# Altium schematic sheet ADC-RDC-FPGA.SchDoc
size A3
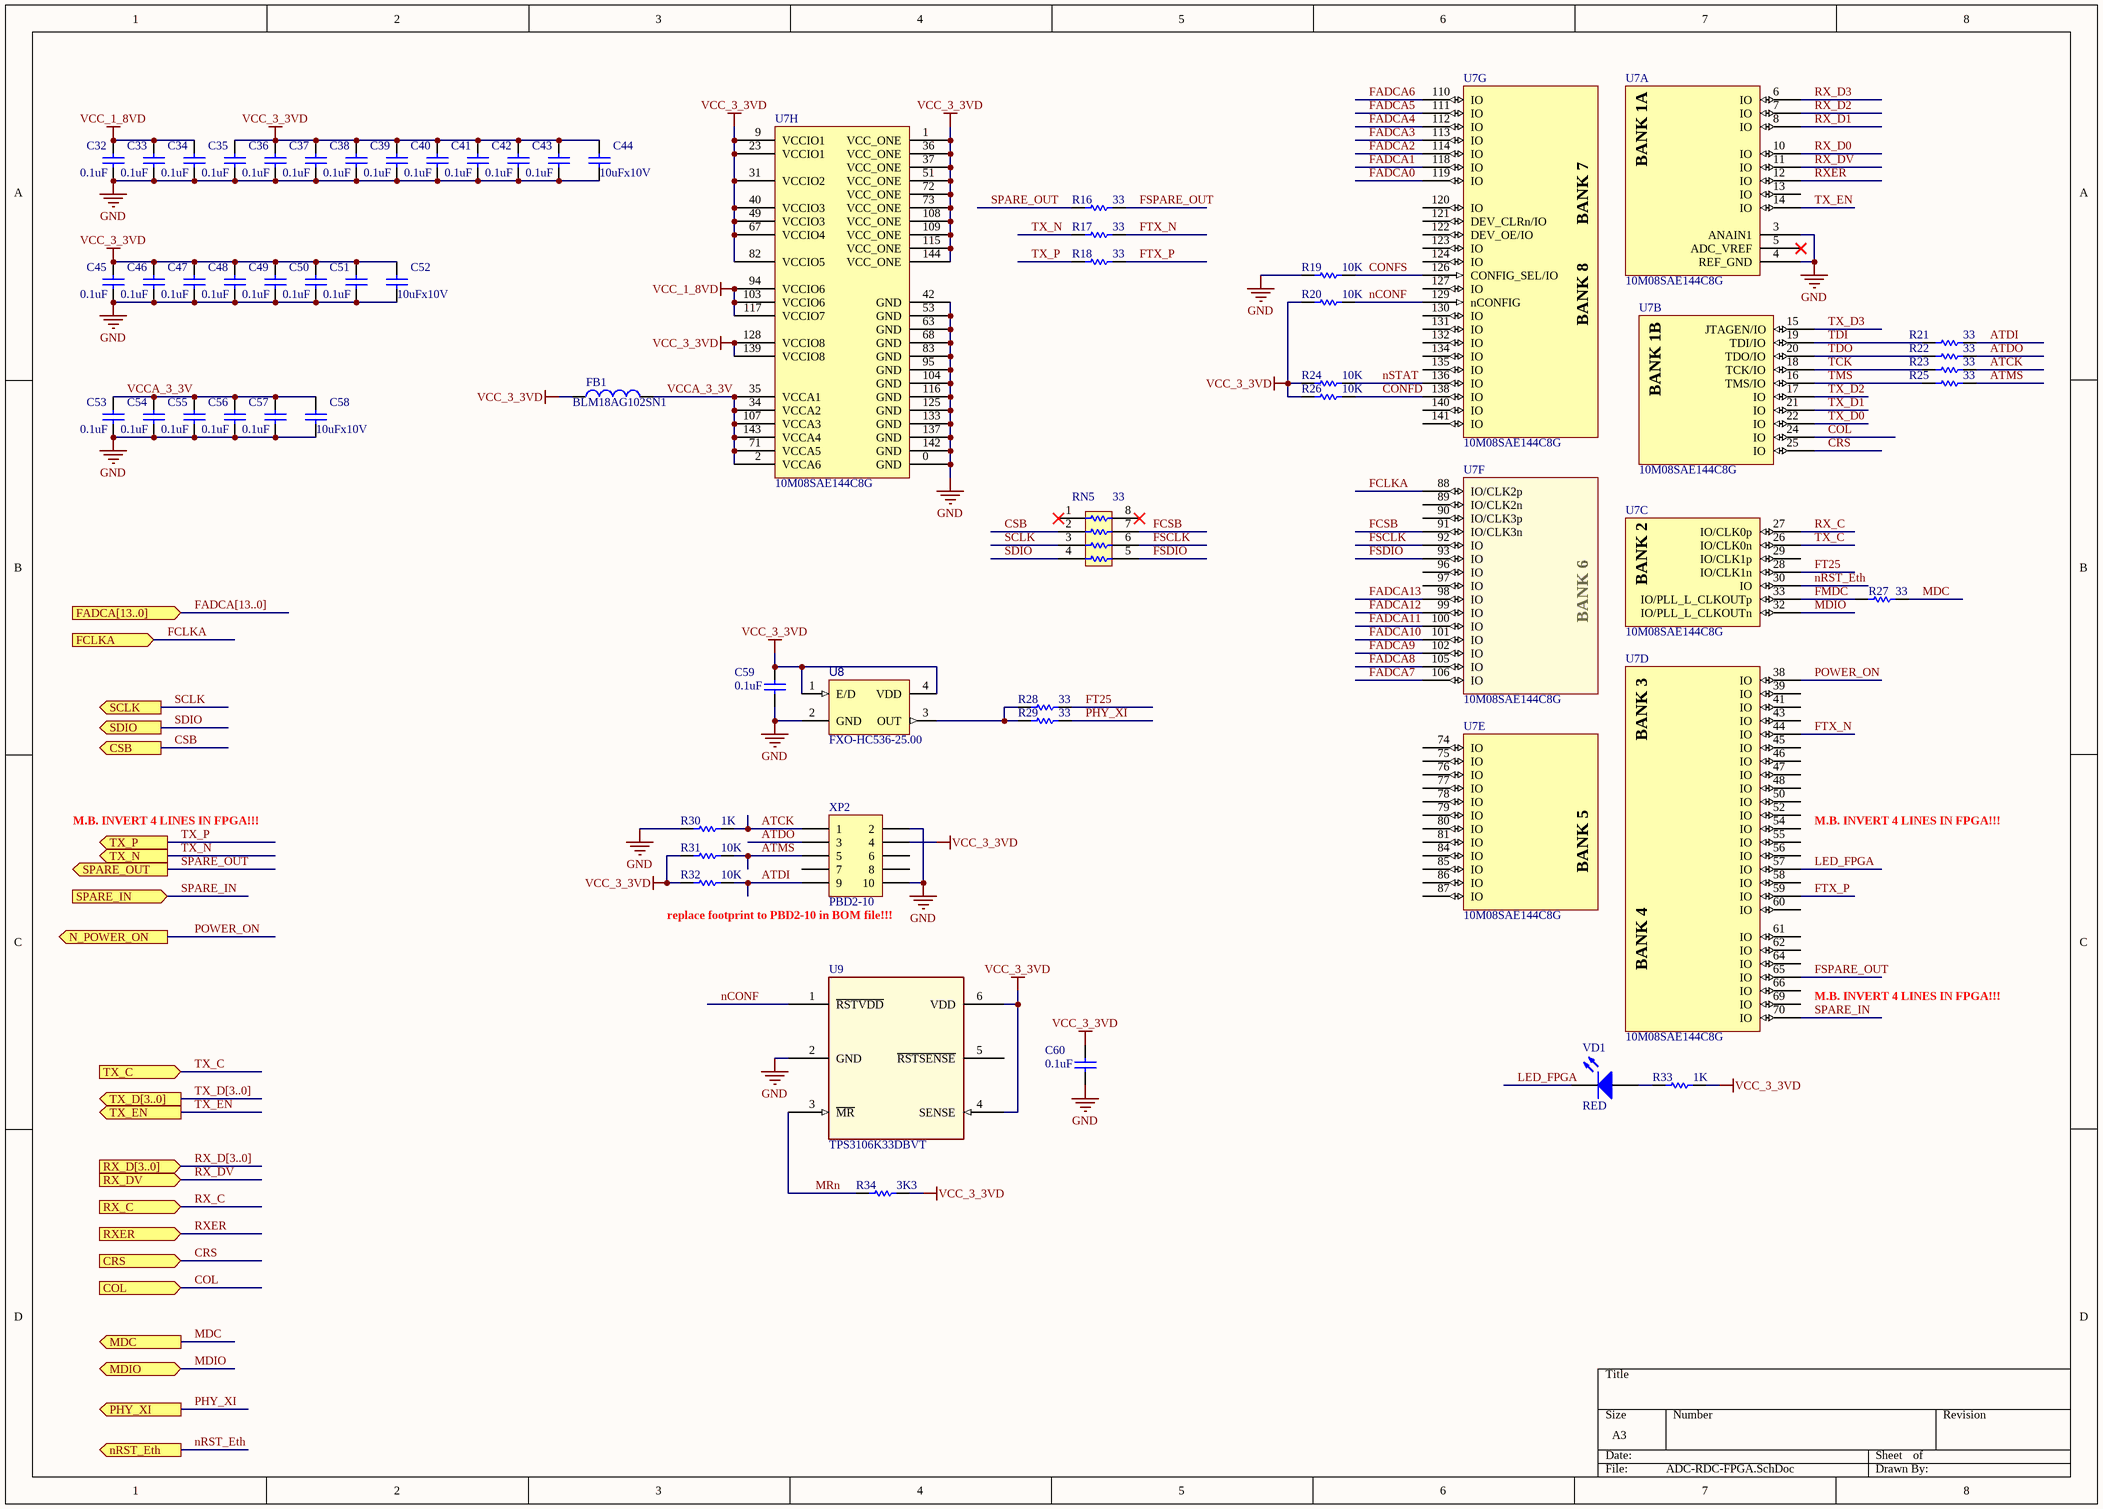
[diagram p0: ADC-RDC-FPGA.SchDoc]

## Parts
C32  0.1uF  [C0603]
C33  0.1uF  [C0603]
C34  0.1uF  [C0603]
C35  0.1uF  [C0603]
C36  0.1uF  [C0603]
C37  0.1uF  [C0603]
C38  0.1uF  [C0603]
C39  0.1uF  [C0603]
C40  0.1uF  [C0603]
C41  0.1uF  [C0603]
C42  0.1uF  [C0603]
C43  0.1uF  [C0603]
C44  10uFx10V  [C0805]
C45  0.1uF  [C0603]
C46  0.1uF  [C0603]
C47  0.1uF  [C0603]
C48  0.1uF  [C0603]
C49  0.1uF  [C0603]
C50  0.1uF  [C0603]
C51  0.1uF  [C0603]
C52  10uFx10V  [C0805]
C53  0.1uF  [C0603]
C54  0.1uF  [C0603]
C55  0.1uF  [C0603]
C56  0.1uF  [C0603]
C57  0.1uF  [C0603]
C58  10uFx10V  [C0805]
C59  0.1uF  [C0603]
C60  0.1uF  [C0603]
FB1  BLM18AG102SN1  [R0603]
R16  33  [R0603]
R17  33  [R0603]
R18  33  [R0603]
R19  10K  [R0603]
R20  10K  [R0603]
R21  33  [R0603]
R22  33  [R0603]
R23  33  [R0603]
R24  10K  [R0603]
R25  33  [R0603]
R26  10K  [R0603]
R27  33  [R0603]
R28  33  [R0603]
R29  33  [R0603]
R30  1K  [R0603]
R31  10K  [R0603]
R32  10K  [R0603]
R33  1K  [R0603]
R34  3K3  [R0603]
RN5  33  [EXB38V]
U7  10M08SAE144C8G  [EQFP144_L]  (parts A,B,C,D,E,F,G,H of 8)
U8  FXO-HC536-25.00  [HC5]
U9  TPS3106K33DBVT  [SOT23-6]
VD1  RED  [D0805]
XP2  PBD2-10  [PLD2-10]

## Ports
COL (in), CRS (in), CSB (out), FADCA[13..0] (in), FCLKA (in), MDC (out), MDIO (bidir), N_POWER_ON (out), nRST_Eth (out), PHY_XI (out), RX_C (in), RX_D[3..0] (in), RX_DV (in), RXER (in), SCLK (out), SDIO (out), SPARE_IN (in), SPARE_OUT (out), TX_C (in), TX_D[3..0] (out), TX_EN (out), TX_N (out), TX_P (out)

## Nets
GND: C32.1 C33.1 C34.1 C35.1 C36.1 C37.1 C38.1 C39.1 C40.1 C41.1 C42.1 C43.1 C44.2 C45.1 C46.1 C47.1 C48.1 C49.1 C50.1 C51.1 C52.2 C53.1 C54.1 C55.1 C56.1 C57.1 C58.2 C59.1 C60.1 R19.1 R30.1 U7.0(GND) U7.3(ANAIN1) U7.4(REF_GND) U7.42(GND) U7.53(GND) U7.63(GND) U7.68(GND) U7.83(GND) U7.95(GND) U7.104(GND) U7.116(GND) U7.125(GND) U7.133(GND) U7.137(GND) U7.142(GND) U8.2(GND) U9.2(GND) XP2.2 XP2.10
VCC_1_8VD: C32.2 C33.2 C34.2 U7.94(VCCIO6) U7.103(VCCIO6) U7.117(VCCIO7)
VCC_3_3VD: C35.2 C36.2 C37.2 C38.2 C39.2 C40.2 C41.2 C42.2 C43.2 C44.1 C45.2 C46.2 C47.2 C48.2 C49.2 C50.2 C51.2 C52.1 C59.2 C60.2 FB1.2 R20.1 R24.1 R26.1 R31.1 R32.1 R33.1 R34.2 U7.1(VCC_ONE) U7.9(VCCIO1) U7.23(VCCIO1) U7.31(VCCIO2) U7.36(VCC_ONE) U7.37(VCC_ONE) U7.40(VCCIO3) U7.49(VCCIO3) U7.51(VCC_ONE) U7.67(VCCIO4) U7.72(VCC_ONE) U7.73(VCC_ONE) U7.82(VCCIO5) U7.108(VCC_ONE) U7.109(VCC_ONE) U7.115(VCC_ONE) U7.128(VCCIO8) U7.139(VCCIO8) U7.144(VCC_ONE) U8.1(E/D) U8.4(VDD) U9.4(SENSE) U9.6(VDD) XP2.4
ATCK: R23.2 R30.2 XP2.1
ATDI: R21.2 R32.2 XP2.9
ATDO: R22.2 XP2.3
ATMS: R25.2 R31.2 XP2.5
COL: U7.24(IO) ; port COL
CONFD: R26.2 U7.138(IO)
CONFS: R19.2 U7.126(CONFIG_SEL/IO)
CRS: U7.25(IO) ; port CRS
CSB: RN5.2 ; port CSB
FADCA0: U7.119(IO)
FADCA1: U7.118(IO)
FADCA2: U7.114(IO)
FADCA3: U7.113(IO)
FADCA4: U7.112(IO)
FADCA5: U7.111(IO)
FADCA6: U7.110(IO)
FADCA7: U7.106(IO)
FADCA8: U7.105(IO)
FADCA9: U7.102(IO)
FADCA10: U7.101(IO)
FADCA11: U7.100(IO)
FADCA12: U7.99(IO)
FADCA13: U7.98(IO)
FCLKA: U7.88(IO/CLK2p) ; port FCLKA
FCSB: RN5.7 U7.91(IO/CLK3n)
FMDC: R27.1 U7.33(IO/PLL_L_CLKOUTp)
FSCLK: RN5.6 U7.92(IO)
FSDIO: RN5.5 U7.93(IO)
FSPARE_OUT: R16.2 U7.65(IO)
FT25: R28.2 U7.28(IO/CLK1n)
FTX_N: R17.2 U7.44(IO)
FTX_P: R18.2 U7.59(IO)
LED_FPGA: U7.57(IO) VD1.2(K)
MDC: R27.2 ; port MDC
MDIO: U7.32(IO/PLL_L_CLKOUTn) ; port MDIO
MRn: R34.1 U9.3(~{MR})
nCONF: R20.2 U7.129(nCONFIG) U9.1(~{RSTVDD})
nRST_Eth: U7.30(IO) ; port nRST_Eth
nSTAT: R24.2 U7.136(IO)
PHY_XI: R29.2 ; port PHY_XI
POWER_ON: U7.38(IO) ; port N_POWER_ON
RX_C: U7.27(IO/CLK0p) ; port RX_C
RX_D0: U7.10(IO)
RX_D1: U7.8(IO)
RX_D2: U7.7(IO)
RX_D3: U7.6(IO)
RX_DV: U7.11(IO) ; port RX_DV
RXER: U7.12(IO) ; port RXER
SCLK: RN5.3 ; port SCLK
SDIO: RN5.4 ; port SDIO
SPARE_IN: U7.70(IO) ; port SPARE_IN
SPARE_OUT: R16.1 ; port SPARE_OUT
TCK: R23.1 U7.18(TCK/IO)
TDI: R21.1 U7.19(TDI/IO)
TDO: R22.1 U7.20(TDO/IO)
TMS: R25.1 U7.16(TMS/IO)
TX_C: U7.26(IO/CLK0n) ; port TX_C
TX_D0: U7.22(IO)
TX_D1: U7.21(IO)
TX_D2: U7.17(IO)
TX_D3: U7.15(JTAGEN/IO)
TX_EN: U7.14(IO) ; port TX_EN
TX_N: R17.1 ; port TX_N
TX_P: R18.1 ; port TX_P
VCCA_3_3V: C53.2 C54.2 C55.2 C56.2 C57.2 C58.1 FB1.1 U7.2(VCCA6) U7.34(VCCA2) U7.35(VCCA1) U7.71(VCCA5) U7.107(VCCA3) U7.143(VCCA4)
NetR28_1: R28.1 R29.1 U8.3(OUT)
NetR33_2: R33.2 VD1.1(A)

Not connected (* = marked no-connect by the designer): RN5 1* 8*; U7 5(ADC_VREF)* 13(IO) 29(IO/CLK1p) 39(IO) 41(IO) 43(IO) 45(IO) 46(IO) 47(IO) 48(IO) 50(IO) 52(IO) 54(IO) 55(IO) 56(IO) 58(IO) 60(IO) 61(IO) 62(IO) 64(IO) 66(IO) 69(IO) 74(IO) 75(IO) 76(IO) 77(IO) 78(IO) 79(IO) 80(IO) 81(IO) 84(IO) 85(IO) 86(IO) 87(IO) 89(IO/CLK2n) 90(IO/CLK3p) 96(IO) 97(IO) 120(IO) 121(DEV_CLRn/IO) 122(DEV_OE/IO) 123(IO) 124(IO) 127(IO) 130(IO) 131(IO) 132(IO) 134(IO) 135(IO) 140(IO) 141(IO); U9 5(~{RSTSENSE}); XP2 6 7 8

## Buses and harness runs
bus FADCA[13..0] = port FADCA[13..0]
bus RX_D[3..0] = port RX_D[3..0]
bus TX_D[3..0] = port TX_D[3..0]

## Notes on the sheet
- M.B. INVERT 4 LINES IN FPGA!!!
- replace footprint to PBD2-10 in BOM file!!!
- (in symbol 10M04SAE144C8G, part A) BANK 1A
- (in symbol 10M04SAE144C8G, part B) BANK 1B
- (in symbol 10M04SAE144C8G, part C) BANK 2
- (in symbol 10M04SAE144C8G, part D) BANK 3; BANK 4
- (in symbol 10M04SAE144C8G, part E) BANK 5
- (in symbol 10M04SAE144C8G, part F) BANK 6
- (in symbol 10M04SAE144C8G, part G) BANK 7; BANK 8

## Library data of the parts
C32-C60 = Cap: Capacitor, 2pin; ValueSCH: *; ValueBOM: *; MarkPCB: *
FB1 = Inductor: Inductor, 2pin; ValueSCH: *; ValueBOM: *; MarkPCB: *
R16-R34 = RES: Resistor, 2pin; ValueSCH: *; ValueBOM: *; MarkPCB: *
RN5 = x4 Resistor Array: ValueSCH: *; ValueBOM: *; MarkPCB: *
U7 = 10M04SAE144C8G: Cyclone III Family FPGA, 94 I/O Pins, 4 PLLs, 144-Pin EQFP, Speed Grade 8, Commercial Grade, Pb-Free; ValueBOM: *; ValueSCH: *; MarkPCB: *
U8 = SG-636PTF-40.0000: Surface Mount Crystal Oscillator; MarkPCB: *; ValueBOM: *; ValueSCH: *
U9 = TPS3106: MarkPCB: *; ValueBOM: *; ValueSCH: *
VD1 = LED: Typical GaAs LED; ValueSCH: *; ValueBOM: *; MarkPCB: *
XP2 = Header 5X2: Header, 5-Pin, Dual row; ValueSCH: *; ValueBOM: *; MarkPCB: *